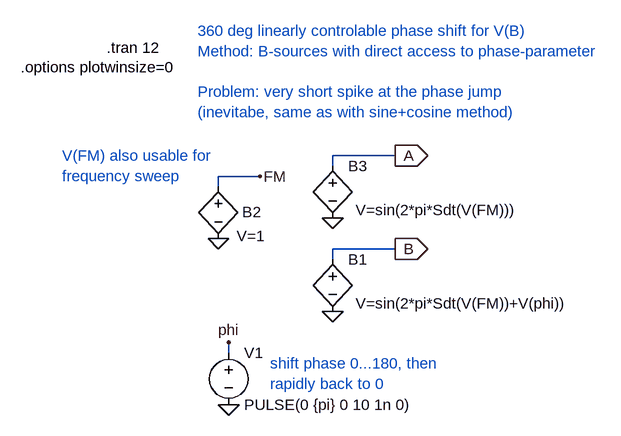
[diagram p0: schematic ctrl_phase_shift_3.asc]
ctrl_phase_shift_3.asc, the LTspice schematic file:
Version 4
SHEET 1 880 680
WIRE -240 112 -240 96
WIRE -224 368 -224 352
WIRE -176 96 -240 96
WIRE -64 80 -64 64
WIRE -64 224 -64 208
WIRE 32 64 -64 64
WIRE 32 208 -64 208
FLAG -64 304 0
FLAG 32 208 B
IOPIN 32 208 Out
FLAG -240 192 0
FLAG -176 96 FM
FLAG -64 160 0
FLAG 32 64 A
IOPIN 32 64 Out
FLAG -224 448 0
FLAG -224 352 phi
SYMBOL bv -64 208 R0
WINDOW 3 35 84 Left 0
SYMATTR Value V=sin(2*pi*Sdt(V(FM))+V(phi))
SYMATTR InstName B1
SYMBOL bv -240 96 R0
WINDOW 3 28 92 Left 0
WINDOW 0 37 55 Left 0
SYMATTR Value V=1
SYMATTR InstName B2
SYMBOL bv -64 64 R0
WINDOW 3 35 84 Left 0
SYMATTR Value V=sin(2*pi*Sdt(V(FM)))
SYMATTR InstName B3
SYMBOL voltage -224 352 R0
WINDOW 123 0 0 Left 0
WINDOW 39 0 0 Left 0
SYMATTR InstName V1
SYMATTR Value PULSE(0 {pi} 0 10 1n 0)
TEXT -412 -102 Left 0 !.tran 12
TEXT -544 -72 Left 0 !.options plotwinsize=0
TEXT -160 384 Left 0 ;shift phase 0...180, then\nrapidly back to 0
TEXT -272 -128 Left 0 ;360 deg linearly controlable phase shift for V(B)\nMethod: B-sources with direct access to phase-parameter\n \nProblem: very short spike at the phase jump\n(inevitabe, same as with sine+cosine method)
TEXT -480 64 Left 0 ;V(FM) also usable for\nfrequency sweep

The netlist it stands for:
* ctrl_phase_shift_3.asc
B1 B 0 V=sin(2*pi*Sdt(V(FM))+V(phi))
B2 FM 0 V=1
B3 A 0 V=sin(2*pi*Sdt(V(FM)))
V1 phi 0 PULSE(0 {pi} 0 10 1n 0)
.tran 12
.options plotwinsize=0
* shift phase 0...180, then
* rapidly back to 0
* 360 deg linearly controlable phase shift for V(B)
* Method: B-sources with direct access to phase-parameter
* Problem: very short spike at the phase jump
* (inevitabe, same as with sine+cosine method)
* V(FM) also usable for
* frequency sweep
.backanno
.end